# Altium schematic sheet S2 - SWITCHES.SchDoc: DEBOUNCED SWITCH CONFIGURATIONS
size A; FIELD_1: 1; FIELD_2: 2; FIELD_3: 3; FIELD_4: 4; FIELD_5: 5; FIELD_6: 6; FIELD_7: 7; FIELD_8: 8; Engineer: M. TALEBI; Organization: MACHINE INTELLIGENCE LAB; Revision: 0; Project: BLUETOOTH SYSTEM STATUS BOARD
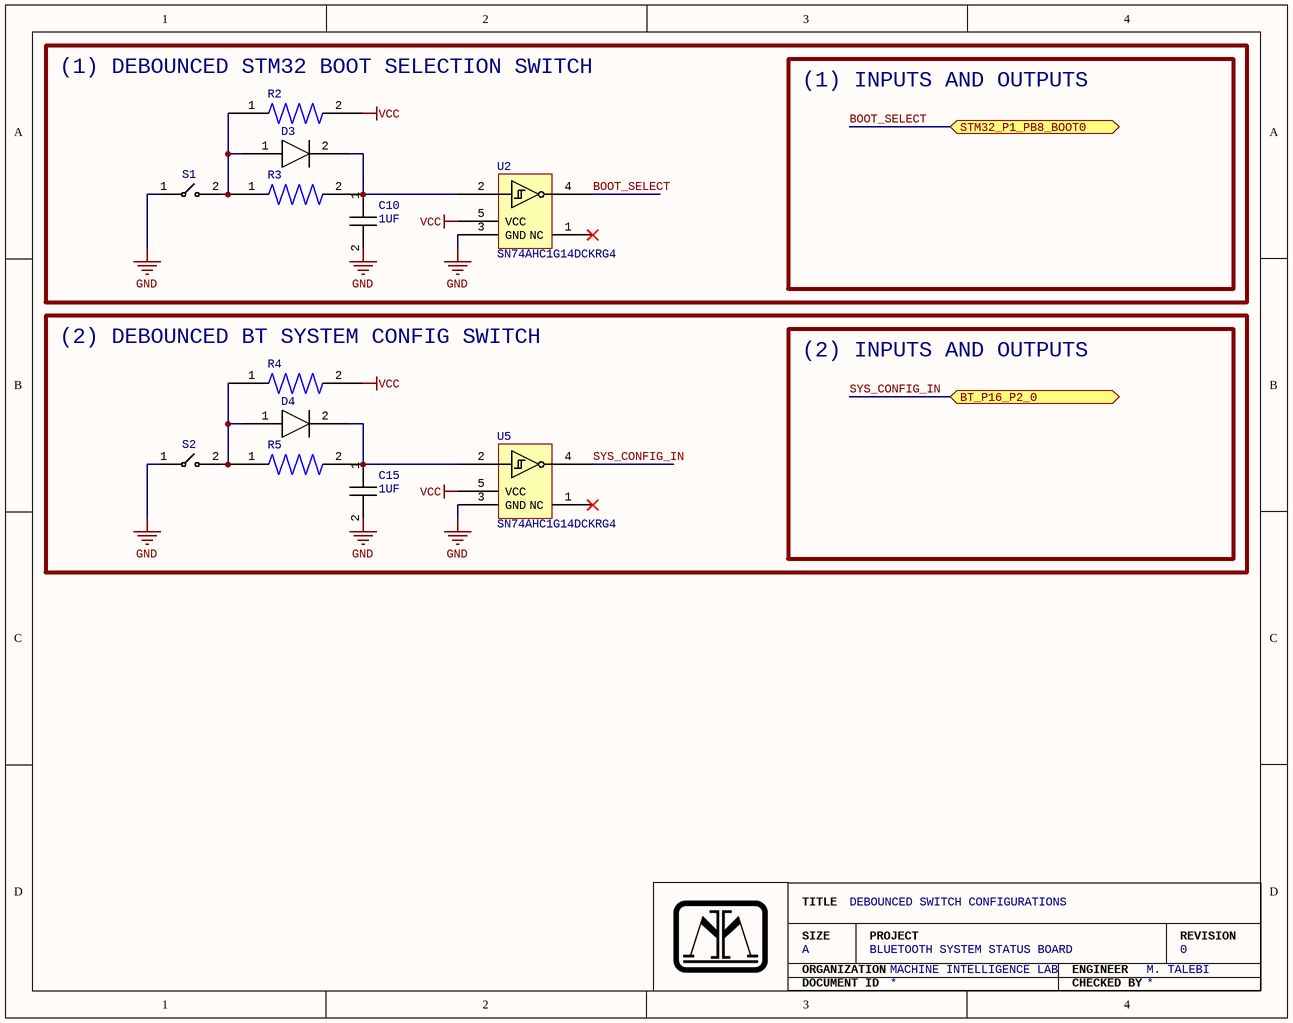
[diagram p0: S2 - SWITCHES.SchDoc]

## Parts
C10  1UF  [CL10A105KQ8NNNC]
C15  1UF  [CL10A105KQ8NNNC]
D3  RS1K-13-F  [RS1K-13-F]  (value not drawn)
D4  RS1K-13-F  [RS1K-13-F]  (value not drawn)
R2  RT1206BRD0740KL  [RT1206BRD0740KL]  (value not drawn)
R3  RT1206BRD0740KL  [RT1206BRD0740KL]  (value not drawn)
R4  RT1206BRD0740KL  [RT1206BRD0740KL]  (value not drawn)
R5  RT1206BRD0740KL  [RT1206BRD0740KL]  (value not drawn)
S1  L101011MS02Q  [L101011MS02Q]  (value not drawn)
S2  L101011MS02Q  [L101011MS02Q]  (value not drawn)
U2  SN74AHC1G14DCKRG4  [SN74AHC1G14DCKRG4]
U5  SN74AHC1G14DCKRG4  [SN74AHC1G14DCKRG4]

## Ports
BT_P16_P2_0 (bidir), STM32_P1_PB8_BOOT0 (bidir)

## Nets
GND: C10.2 C15.2 S1.1 S2.1 U2.3(GND) U5.3(GND)
VCC: R2.2 R4.2 U2.5(VCC) U5.5(VCC)
BOOT_SELECT: U2.4 ; port STM32_P1_PB8_BOOT0
SYS_CONFIG_IN: U5.4 ; port BT_P16_P2_0
NetC10_1: C10.1 D3.2(+) R3.2 U2.2
NetC15_1: C15.1 D4.2(+) R5.2 U5.2
NetD3_1: D3.1(-) R2.1 R3.1 S1.2
NetD4_1: D4.1(-) R4.1 R5.1 S2.2

Not connected (* = marked no-connect by the designer): U2 1(NC)*; U5 1(NC)*

## Notes on the sheet
- (near R2) (1) DEBOUNCED STM32 BOOT SELECTION SWITCH
- (1) INPUTS AND OUTPUTS
- (near R4) (2) DEBOUNCED BT SYSTEM CONFIG SWITCH
- (2) INPUTS AND OUTPUTS
- TITLE
- SIZE
- ORGANIZATION
- A
- PROJECT
- ENGINEER
- REVISION
- DOCUMENT ID
- CHECKED BY

## Library data of the parts
C10 C15 = CL10A105KQ8NNNC: CAP CER 1UF 6.3V X5R 0603; Tolerance: ±10%; Capacitance: 1 µF; Voltage - Rated: 6.3V; Temperature Coefficient: X5R; Operating Temperature: -55°C ~ 85°C; Applications: General Purpose; Mounting Type: Surface Mount, MLCC; Package / Case: 0603 (1608 Metric); Size / Dimension: 0.063" L x 0.031" W (1.60mm x 0.80mm); Thickness (Max): 0.035" (0.90mm); Supplier 1: Digi-Key; Supplier Part Number 1: 1276-1036-1-ND; ComponentLink1Description: Datasheet; ComponentLink1URL: https://www.samsungsem.com/resources/file/global/support/product_catalog/MLCC.pdf
D3 D4 = RS1K-13-F: DIODE GEN PURP 800V 1A SMA; Diode Type: Standard; Speed: Fast Recovery =< 500ns, > 200mA (Io); Capacitance @ Vr, F: 15pF @ 4V, 1MHz; Reverse Recovery Time (trr): 500 ns; Voltage - Forward (Vf) (Max) @ If: 1.3 V @ 1 A; Current - Reverse Leakage @ Vr: 5 µA @ 800 V; Current - Average Rectified (Io): 1A; Mounting Type: Surface Mount; Package / Case: DO-214AC, SMA; Supplier Device Package: SMA; Operating Temperature - Junction: -65°C ~ 150°C; Voltage - DC Reverse (Vr) (Max): 800 V; ComponentLink1Description: Datasheet; ComponentLink1URL: https://www.diodes.com/assets/Datasheets/ds15002.pdf
R2-R5 = RT1206BRD0740KL: RES SMD 40K OHM 0.1% 1/4W 1206; Power (Watts): 0.25W, 1/4W; Temperature Coefficient: ±25ppm/°C; Resistance: 40 kOhms; Tolerance: ±0.1%; Composition: Thin Film; Operating Temperature: -55°C ~ 155°C; Package / Case: 1206 (3216 Metric); Supplier Device Package: 1206; Size / Dimension: 0.122" L x 0.063" W (3.10mm x 1.60mm); Height - Seated (Max): 0.026" (0.65mm); Number of Terminations: 2; ComponentLink1Description: Datasheet; ComponentLink1URL: https://www.yageo.com/upload/media/product/productsearch/datasheet/rchip/PYu-RT_1-to-0.01_RoHS_L_12.pdf; Supplier 1: Digi-Key; Supplier Part Number 1: 13-RT1206BRD0740KLCT-ND
S1 S2 = L101011MS02Q: SWITCH SLIDE SPST 4A 125V; Contact Timing: Not Specified; Switch Function: On-Off; Current Rating (Amps): 4A (AC/DC); Actuator Type: Standard; Actuator Length: 5.08mm; Actuator Material: Polyamide (PA66), Nylon 6/6; Switch Travel: 3.81mm; Electrical Life: 10,000 Cycles; Voltage Rating - DC: 28 V; Circuit: SPST; Contact Material: Copper; Contact Finish: Silver; Mounting Type: Through Hole; Termination Style: PC Pin; Operating Temperature: -30°C ~ 65°C; Voltage Rating - AC: 125 V; ComponentLink1Description: Datasheet; ComponentLink1URL: https://www.ckswitches.com/media/1423/l.pdf; Supplier 1: Digi-Key; Supplier Part Number 1: CKC5106-ND
U2 U5 = SN74AHC1G14DCKRG4: IC INVERT SCHMITT 1CH 1IN SC70; Logic Type: Inverter; Number of Inputs: 1; Voltage - Supply: 2V ~ 5.5V; Current - Output High, Low: 8mA, 8mA; Logic Level - Low: 0.9V ~ 1.65V; Logic Level - High: 2.2V ~ 3.85V; Max Propagation Delay @ V, Max CL: 10.6ns @ 5V, 50pF; Current - Quiescent (Max): 1 µA; Features: Schmitt Trigger; Operating Temperature: -40°C ~ 125°C; Mounting Type: Surface Mount; Supplier Device Package: SC-70-5; Package / Case: 5-TSSOP, SC-70-5, SOT-353; Number of Circuits: 1